# EasyEDA Pro project ProDoc_眼部追踪摄像头主控板.epro

# Schematic Schematic1
Board Name: 主控板1.2; Create Date: 2025-11-02; Page Name: P1; Project Name: FAICAL TRACKER VR模块; Schematic Name: Schematic1_2; Update Date: 2025-12-16; BladeWidth: 10; Company: 嘉立创EDA; Page Size: A4; RegionStart: 1; ShowBorder: 1; TitleBlock: 1; TitleBlockPosition: 3; Version: V1.0; XRegionCount: 6; YRegionCount: 4
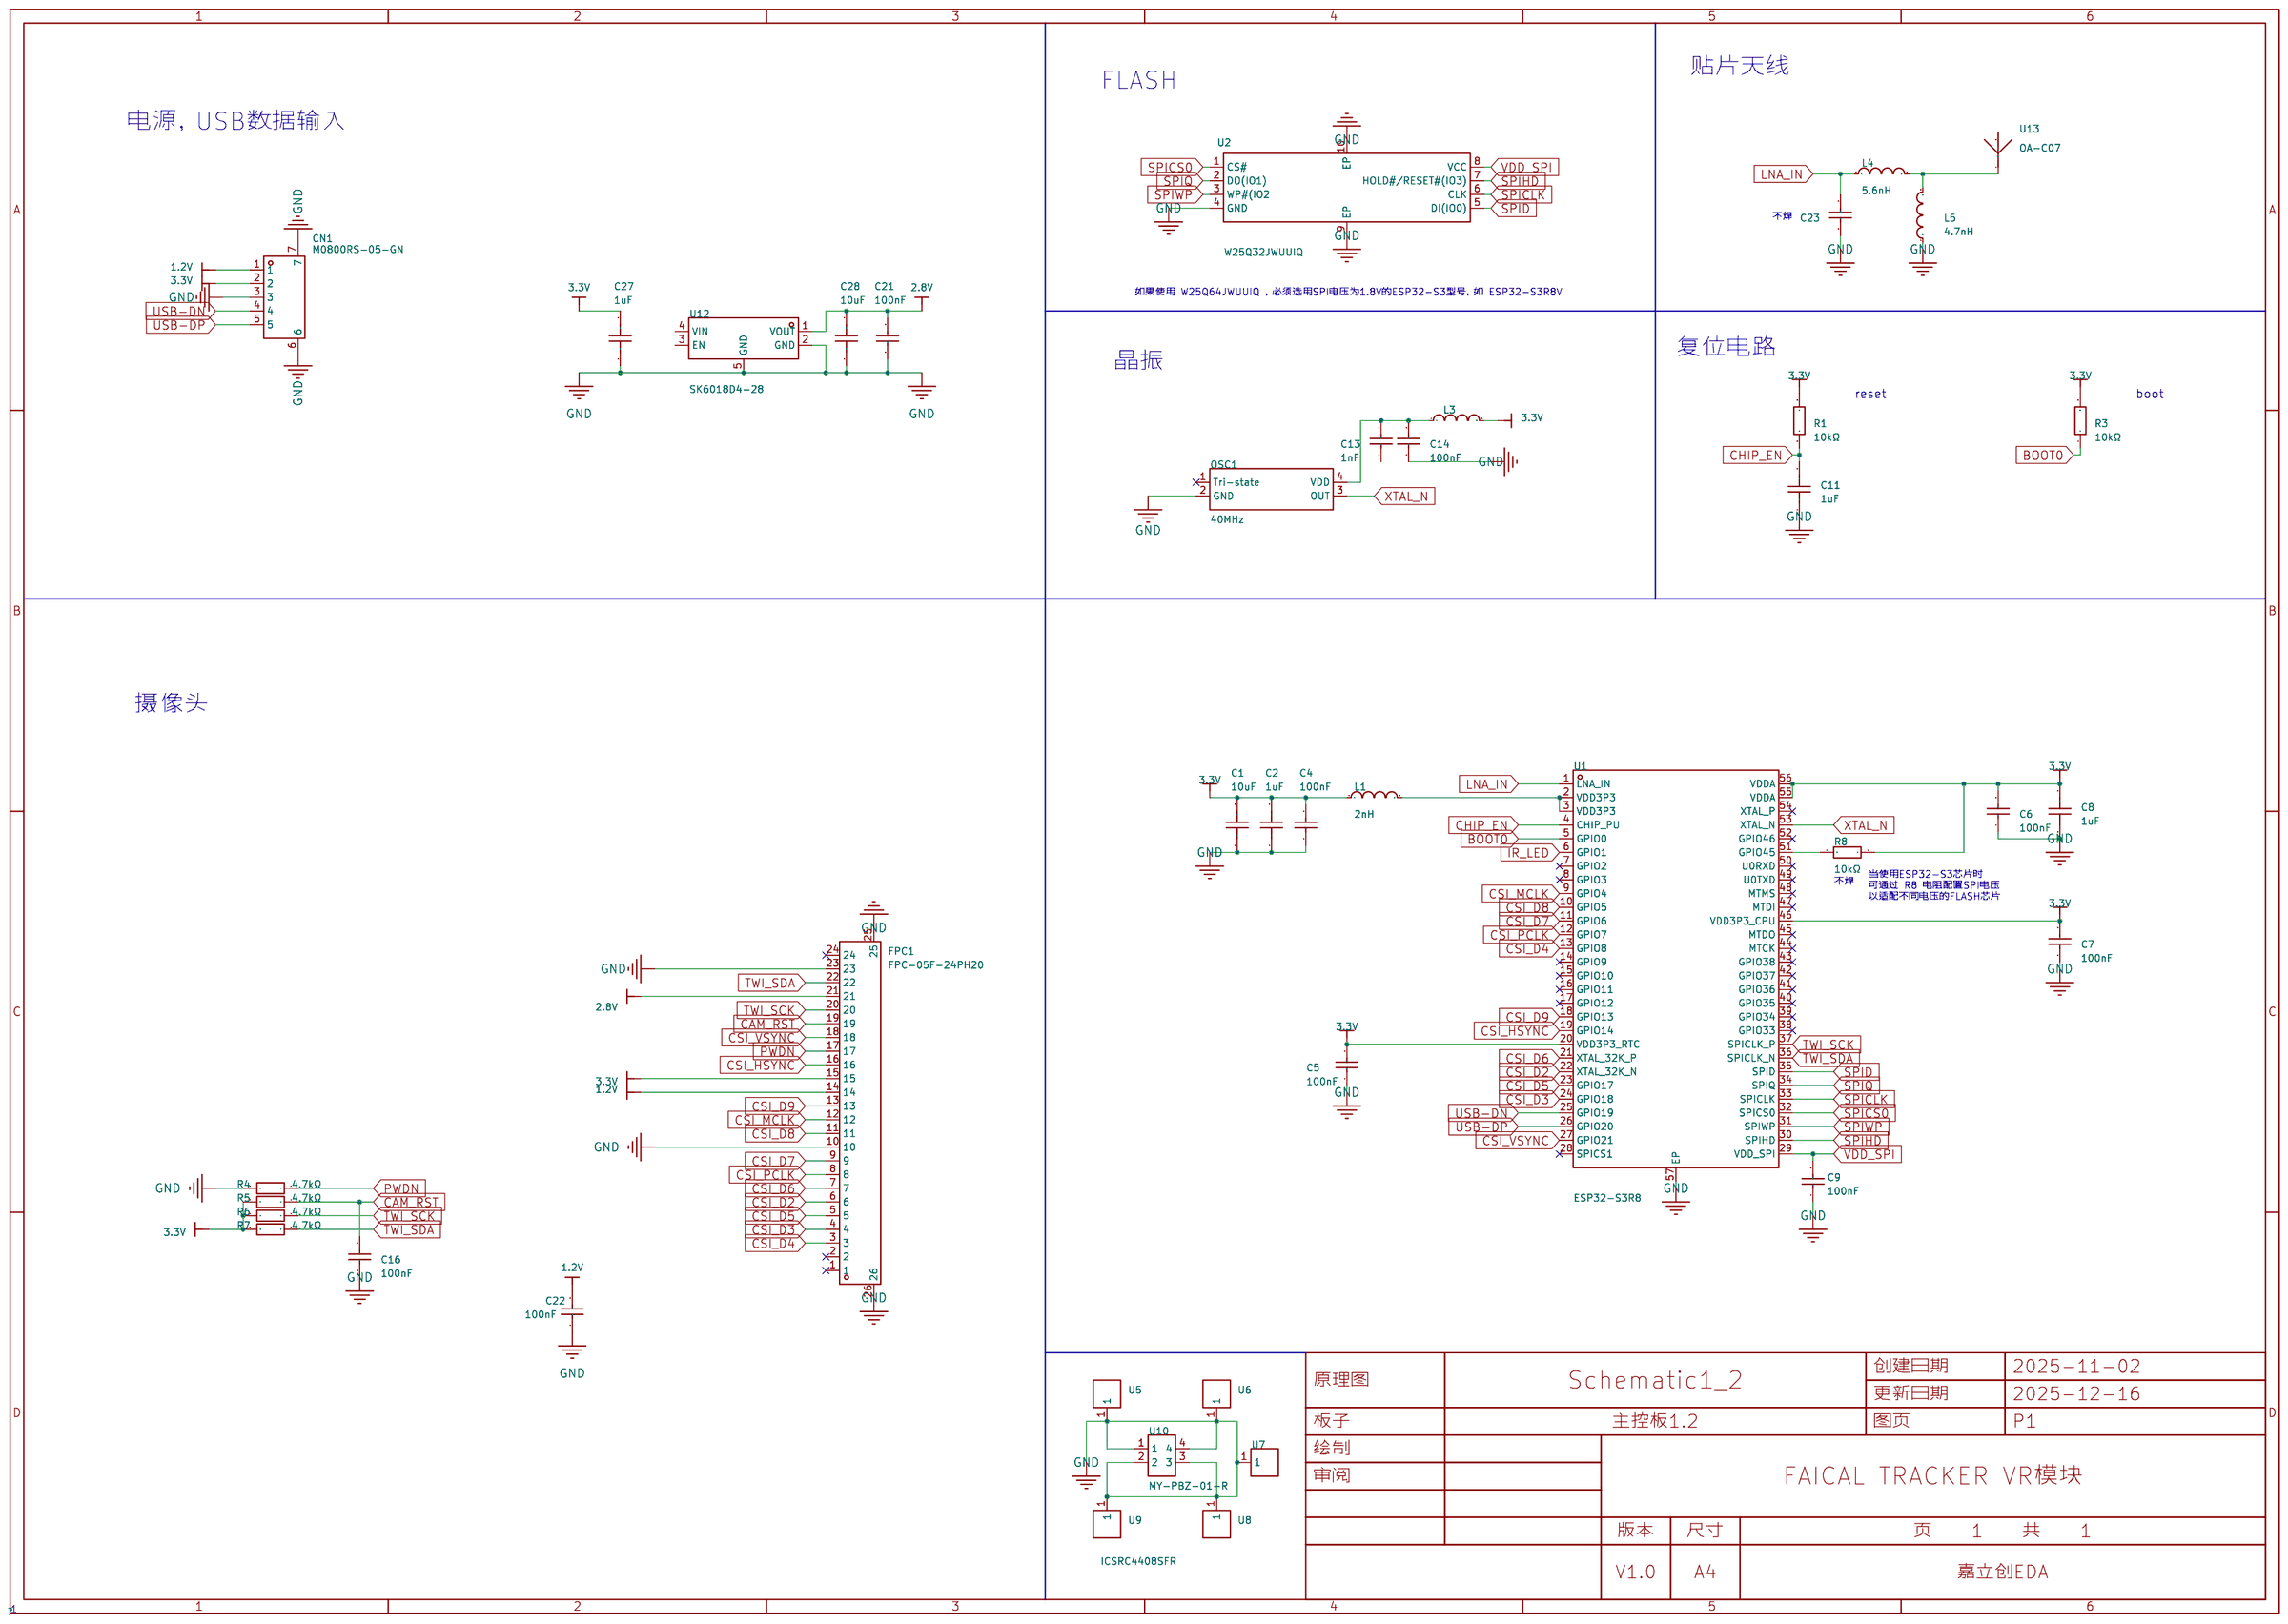
[diagram p0: schematic sheet]

## Parts
C1  10uF  [0402]
C2  1uF  [0402]
C4  100nF  [0402]
C5  100nF  [0402]
C6  100nF  [0402]
C7  100nF  [0402]
C8  1uF  [0402]
C9  100nF  [0402]
C11  1uF  [0402]
C13  1nF  [0402]
C14  100nF  [0402]
C16  100nF  [0402]
C21  100nF  [0402]
C22  100nF  [0402]
C23  1pF  [0402]
C27  1uF  [0402]
C28  10uF  [0402]
CN1  M0800RS-05-GN  [CONN-SMD_M0800RS-05-GN]
FPC1  FPC-05F-24PH20  [FPC-SMD_24P-P0.50_FPC-05F-24PH20]
L1  2nH  [0402]
L3  BLM15PD121SN1D  [0402]
L4  5.6nH  [0402]
L5  4.7nH  [0402]
OSC1  40MHz  [OSC-SMD_4P-L2.0-W1.6-BL_S1D25.000000E10F30T]
R1  10kΩ  [0402]
R3  10kΩ  [0402]
R4  4.7kΩ  [0402]
R5  4.7kΩ  [0402]
R6  4.7kΩ  [0402]
R7  4.7kΩ  [0402]
R8  10kΩ  [0402]
U1  ESP32-S3R8  [QFN-56_L7.0-W7.0-P0.40-TL-EP4.0]
U2  W25Q32JWUUIQ  [USON-8_L4.0-W3.0-P0.80-BL_WINBOND_UU]
U5  ICSRC4408SFR  [屏蔽夹 4.4*0.8]
U6  ICSRC4408SFR  [屏蔽夹 4.4*0.8]
U7  ICSRC4408SFR  [屏蔽夹 4.4*0.8]
U8  ICSRC4408SFR  [屏蔽夹 4.4*0.8]
U9  ICSRC4408SFR  [屏蔽夹 4.4*0.8]
U10  MY-PBZ-01-R  [CONN-SMD_MY-PBZ-01-R]
U12  SK6018D4-28  [XDFN-4_L1.0-W1.0-P0.65-BL-EP]
U13  OA-C07  [ANT-SMD_OA-C07]

## Library data of the parts
C1 C28 = CL05A106MP5NUNC: 容值:10uF;精度:±20%;额定电压:10V;材质(温度系数):X5R;; LCSC Part Name: 10uF ±20% 10V; Supplier Part: C315248; Manufacturer: SAMSUNG(三星); JLCPCB Part Class: Extended Part; Datasheet: https://atta.szlcsc.com/upload/public/pdf/source/20231220/1EF805BAE1520675928CC4638D279E74.pdf; Supplier: LCSC; Tolerance: ±20%; Voltage Rated: 10V; Temperature Coefficient: X5R
C2 C8 C11 C27 = CL05A105KA5NQNC: 容值:1uF;精度:±10%;额定电压:25V;材质(温度系数):X5R;; LCSC Part Name: 1uF ±10% 25V; Supplier Part: C52923; Manufacturer: SAMSUNG(三星); JLCPCB Part Class: 基础库; Datasheet: https://atta.szlcsc.com/upload/public/pdf/source/20160218/1457707763339.pdf; Supplier: LCSC; Tolerance: ±10%; Voltage Rated: 25V; Temperature Coefficient: X5R
C4-C7 C9 C16 C21 C22 = 0402B104K500NT: 容值:100nF;精度:±10%;额定电压:50V;温度系数:X7R;; LCSC Part Name: 100nF ±10% 50V; Supplier Part: C110251; Manufacturer: FH(风华); JLCPCB Part Class: 扩展库; Datasheet: https://atta.szlcsc.com/upload/public/pdf/source/20200305/C486355_26A10D38EF8C2A5C37091D0039909270.pdf; Supplier: LCSC; Tolerance: ±10%; Voltage Rating: 50V; Temperature Coefficient: X7R
C13 = 0402B102K500NT: 容值:1nF;精度:±10%;额定电压:50V;材质(温度系数):X7R;; LCSC Part Name: 1nF ±10% 50V; Supplier Part: C1523; Manufacturer: FH(风华); JLCPCB Part Class: Basic Part; Datasheet: https://atta.szlcsc.com/upload/public/pdf/source/20200305/C486355_26A10D38EF8C2A5C37091D0039909270.pdf; Supplier: LCSC; Tolerance: ±10%; Voltage Rated: 50V; Temperature Coefficient: X7R
C14 = 0402B104K500NT: 容值:100nF;精度:±10%;额定电压:50V;温度系数:X7R;; LCSC Part Name: 100nF ±10% 50V; Supplier Part: C110251; Manufacturer: FH(风华); JLCPCB Part Class: Extended Part; Datasheet: https://atta.szlcsc.com/upload/public/pdf/source/20200305/C486355_26A10D38EF8C2A5C37091D0039909270.pdf; Supplier: LCSC; Tolerance: ±10%; Voltage Rating: 50V; Temperature Coefficient: X7R
C23 = GJM1555C1H1R0BB01D: 容值:1pF;额定电压:50V;温度系数:C0G;; LCSC Part Name: ±0.1pF 1pF 50V; Supplier Part: C76898; Manufacturer: muRata(村田); JLCPCB Part Class: 扩展库; Datasheet: https://item.szlcsc.com/datasheet/GJM1555C1H1R0BB01D/78025.html; Supplier: LCSC; Voltage Rating: 50V; Temperature Coefficient: C0G
CN1 = M0800RS-05-GN: 插针结构:1x5P;间距:0.8mm;安装方式:卧贴;参考系列:-;总PIN数:5P;排数:1;每排PIN数:5;行距:-;额定电流:-;触头材质:磷青铜;工作温度:-;; LCSC Part Name: 1x5P 间距:0.8mm 卧贴; Supplier Part: C509167; Manufacturer: XFCN(兴飞); Supplier Footprint: SMD,P=0.8mm,卧贴; JLCPCB Part Class: Extended Part; Datasheet: https://item.szlcsc.com/datasheet/M0800RS-05-GN/522976.html; Supplier: LCSC; Pins Structure: 1x5P; Pitch: 0.8mm; Mounting Type: 卧贴; Number of Pins: 5P; Number of Rows: 1; Number of PINs Per Row: 5; Contact Material: 磷青铜; Flame Retardant Rating: UL94V-0; Z-Height of the Board: 1.7mm; Y-Width of Bottom Edge on Board: 2.7mm
FPC1 = FPC-05F-24PH20: 锁定特性:翻盖式;触点类型:下接;触点数量:24P;间距:0.5mm;安装类型:卧贴;工作温度范围:-25℃~+85℃;; LCSC Part Name: 间距:0.5mm P数:24P 翻盖式 下接; Supplier Part: C2856805; Manufacturer: XUNPU(讯普); Supplier Footprint: SMD,P=0.5mm,卧贴; JLCPCB Part Class: 扩展库; Datasheet: https://atta.szlcsc.com/upload/public/pdf/source/20210922/C2856805_8542C20E2D7FF0FC4EEBD919AE0F6905.pdf; Supplier: LCSC; Locking Feature: 翻盖式; Contact Type: 下接; Number of Contacts: 24P; Pitch: 0.5mm; Mounting Type: 卧贴; FFC, FCB Thickness: 0.3mm; Height Above Board: 2mm; Operating Temperature Range: -25℃~+85℃
L1 = MLG1005S2N0BT000: 电感值:2nH;精度:-;额定电流:900mA;饱和电流(Isat):-;直流电阻(DCR):70mΩ;; LCSC Part Name: ±0.1nH 2nH; Supplier Part: C76769; Manufacturer: TDK; JLCPCB Part Class: Extended Part; Datasheet: https://atta.szlcsc.com/upload/public/pdf/source/20240116/5498F69597B6145D9954BDAE22913204.pdf; Supplier: LCSC; Current Rating: 900mA; DC Resistance(DCR): 70mΩ; Q @ Frequency: 7@100MHz; Frequency - Self Resonant: 7.5GHz
L3 = BLM15PD121SN1D: 标称阻抗@测试频率:120Ω@100MHz;误差:±25%;直流电阻(RDC):90mΩ;; LCSC Part Name: 单路 0402磁珠 阻抗120Ω@100MHz; Supplier Part: C76891; Manufacturer: muRata(村田); JLCPCB Part Class: 扩展库; Datasheet: https://atta.szlcsc.com/upload/public/pdf/source/20181120/C333978_3E581FB55966932B05020139ABDE8E01.pdf; Supplier: LCSC; Impedance @ Frequency: 120Ω@100MHz; Tolerance: ±25%; DC Resistance: 90mΩ; Current Rating: 1.3A; Circuits: 1
L4 = VHF100505HQ5N6ST: 电感值:5.6nH;额定电流:300mA;饱和电流(Isat):-;直流电阻(DCR):300mΩ;; Supplier Part: C395073; Manufacturer: FH(风华); JLCPCB Part Class: Extended Part; Datasheet: https://atta.szlcsc.com/upload/public/pdf/source/20230208/097A5FD33363C9318A1C8B9447979AC6.pdf; Supplier: LCSC; Rated Current: 300mA; DC Resistance (DCR): 300mΩ
L5 = VHF100505HQ4N7ST: 电感值:4.7nH;额定电流:300mA;饱和电流(Isat):-;直流电阻(DCR):200mΩ;; LCSC Part Name: ±0.3nH 4.7nH; Supplier Part: C395070; Manufacturer: FH(风华); JLCPCB Part Class: Extended Part; Datasheet: https://item.szlcsc.com/datasheet/VHF100505HQ4N7ST/375486.html; Supplier: LCSC; Current Rating: 300mA; DC Resistance(DCR): 200mΩ
OSC1 = OT7EL89CJI-111YLC-40M: 频率:40MHz;常温频差:±10ppm;输出模式:CMOS;工作电压:1.8V~3.3V;频率稳定度:±20ppm;; LCSC Part Name: YSO110TR 40MHZ 4P 2016 1.8V-3.3V ±10PPM -40~85℃ (±20PPM) CMOS; Supplier Part: C7434947; Manufacturer: YXC(扬兴晶振); Supplier Footprint: SMD2016-4P; JLCPCB Part Class: Extended Part; Datasheet: https://atta.szlcsc.com/upload/public/pdf/source/20240731/596E5F7673E50DA744B7F79F139FB8DF.pdf; Supplier: LCSC; Normal temperature Frequency Tolerance: ±10ppm; Output Type: CMOS; Voltage - Supply: 1.8V~3.3V; Frequency Stability: ±20ppm; Operating Temperature: -40℃~+85℃
R1 R3 R8 = 0402WGF1002TCE: 电阻类型:厚膜电阻;阻值:10kΩ;精度:±1%;功率:62.5mW;最大工作电压:50V;温度系数:±100ppm/℃;; LCSC Part Name: 10kΩ ±1% 62.5mW 厚膜电阻; Supplier Part: C25744; Manufacturer: UNI-ROYAL(厚声); JLCPCB Part Class: 基础库; Datasheet: https://atta.szlcsc.com/upload/public/pdf/source/20200306/C422600_1E6D84923E4A46A82E41ADD87F860B5C.pdf; Supplier: LCSC; Type: 厚膜电阻; Tolerance: ±1%; Power(Watts): 62.5mW; Overload Voltage (Max): 50V; Temperature Coefficient: ±100ppm/℃; Operating Temperature Range: -55℃~+155℃
R4-R7 = 0402WGF4701TCE: 电阻类型:厚膜电阻;阻值:4.7kΩ;精度:±1%;功率:62.5mW;工作电压:50V;温度系数:±100ppm/℃;; LCSC Part Name: 4.7kΩ ±1% 62.5mW 厚膜电阻; Supplier Part: C25900; Manufacturer: UNI-ROYAL(厚声); JLCPCB Part Class: Basic Part; Datasheet: https://item.szlcsc.com/datasheet/0402WGF4701TCE/26643.html; Supplier: LCSC; Type: 厚膜电阻; Tolerance: ±1%; Power(Watts): 62.5mW; Overload Voltage (Max): 50V; Temperature Coefficient: ±100ppm/℃; Operating Temperature Range: -55℃~+155℃; Voltage-Supply(Max): 50V; Operating Temperature: -55℃~+155℃
U1 = ESP32-S3R8: 频率范围:2.412GHz~2.484GHz;接口类型:I2C；I2S；UART；USB；SPI;应用领域:蓝牙；IoT；WiFi;数据速率:150Mbps;灵敏度:-74.2dBm;典型应用频率:2.4GHz;; Supplier Part: C2913194; Manufacturer: ESPRESSIF(乐鑫); Supplier Footprint: QFN-56(7x7); JLCPCB Part Class: Extended Part; Datasheet: https://item.szlcsc.com/datasheet/ESP32-S3R8/3198292.html; Supplier: LCSC; Frequency Range: 2.412GHz~2.484GHz; Interface: I2C；I2S；UART；USB；SPI; Voltage - Supply: 3V~3.6V; Applications: 蓝牙；IoT；WiFi; Output Power: 18.5dBm; Data Rate: 150Mbps; Current Of Transmitting: 283mA; Sensitivity: -74.2dBm; Receive Current: 88mA; Typical Application Frequency: 2.4GHz; Operating Temperature: -40℃~+65℃
U2 = W25Q32JWUUIQ: 接口类型:SPI;存储容量:32Mbit;时钟频率(fc):133MHz;; LCSC Part Name: 支持双路、四路SPI接口的1.8V、32Mbit 串行闪存; Supplier Part: C2760370; Manufacturer: Winbond(华邦); Supplier Footprint: USON-8(3x4); JLCPCB Part Class: Extended Part; Datasheet: https://item.szlcsc.com/datasheet/W25Q32JWUUIQ/2881016.html; Supplier: LCSC; Interface: SPI; Memory Size: 32Mbit; Clock Frequency: 133MHz; Voltage - Supply: 1.7V~1.95V; Program / Erase Cycles: 100000次; Page Programming Time (Tpp): 800us; Block Erase Time(tBE): 120ms@(32KB); Data Retention - TDR (Year): 20年
U5-U9 = ICSRC4408SFR: LCSC Part Name: ICT，屏蔽夹 ，长4.4mm*高0.8mm，ICSRC4408SFR; Supplier Part: C238201; Manufacturer: ICT; JLCPCB Part Class: Extended Part; Datasheet: https://item.szlcsc.com/datasheet/ICSRC4408SFR/237762.html; Supplier: LCSC; size: 4.4mm*0.8mm; colour: 白色
U10 = MY-PBZ-01-R: 屏蔽罩PBZ屏蔽框/屏蔽架/屏蔽盖/阻止产品内部电路和生产的电磁波向外辐射，防尘，材质：洋白铜; LCSC Part Name: 屏蔽罩; Supplier Part: C964879; Manufacturer: MYOUNG(美阳); Supplier Footprint: DIP; JLCPCB Part Class: 扩展库; Datasheet: https://item.szlcsc.com/datasheet/MY-PBZ-01-R/1049845.html; Supplier: LCSC; material quality: 洋白铜; characteristic: 阻止产品内部电路和生产的电磁波向外辐射,防尘; size: 13.84*10.47mm
U12 = SK6018D4-28: 输出类型:固定;工作电压:6.5V;输出电压:2.8V;输出电流:300mA;电源纹波抑制比(PSRR):-;输出极性:正极;; LCSC Part Name: 低压差线性稳压器; Supplier Part: C2682757; Manufacturer: suntek(洺太电子); Supplier Footprint: XDFN-4-EP(1x1); JLCPCB Part Class: Extended Part; Datasheet: https://item.szlcsc.com/datasheet/SK6018D4-28/2777833.html; Supplier: LCSC; Output Type: 固定; Voltage - Supply: 6.5V; Output Voltage: 2.8V; Output Current: 300mA; standby current: 1uA; Features: 带使能; Operating Temperature: -40℃~+85℃@(Ta); Output Configuration: 正极; Number of Outputs: 1
U13 = OA-C07: Supplier Part: C9900003278; Supplier Footprint: SMD; JLCPCB Part Class: 扩展库; Supplier: LCSC

## Nets
1.2V: C22.2 CN1.1 FPC1.15
2.8V: C21.2 C28.2 FPC1.21 U12.1(VOUT)
3.3V: C1.2 C2.2 C4.2 C5.2 C6.2 C7.2 C8.2 C27.2 CN1.2 FPC1.14 L1.1 L3.2 R1.2 R3.2 R5.2 R6.2 R7.2 R8.1 U1.20(VDD3P3_RTC) U1.46(VDD3P3_CPU) U1.55(VDDA) U1.56(VDDA) U12.3(EN) U12.4(VIN)
GND: C1.1 C2.1 C4.1 C5.1 C6.1 C7.1 C8.1 C9.1 C11.1 C13.1 C14.1 C16.1 C21.1 C22.1 C23.1 C27.1 C28.1 CN1.3 CN1.6 CN1.7 FPC1.10 FPC1.23 FPC1.25 FPC1.26 L5.1 OSC1.2(GND) R4.2 U1.57(EP) U2.4(GND) U2.9(EP) U2.10(EP) U5.1 U6.1 U7.1 U8.1 U9.1 U10.1 U10.2 U10.3 U10.4 U12.2(GND) U12.5(GND)
VDD_SPI: C9.2 U1.29(VDD_SPI) U2.8(VCC)
BOOT0: R3.1 U1.5(GPIO0)
CAM_RST: C16.2 FPC1.19 R5.1
CHIP_EN: C11.2 R1.1 U1.4(CHIP_PU)
CSI_D2: FPC1.6 U1.22(XTAL_32K_N)
CSI_D3: FPC1.4 U1.24(GPIO18)
CSI_D4: FPC1.3 U1.13(GPIO8)
CSI_D5: FPC1.5 U1.23(GPIO17)
CSI_D6: FPC1.7 U1.21(XTAL_32K_P)
CSI_D7: FPC1.9 U1.11(GPIO6)
CSI_D8: FPC1.11 U1.10(GPIO5)
CSI_D9: FPC1.13 U1.18(GPIO13)
CSI_HSYNC: FPC1.16 U1.19(GPIO14)
CSI_MCLK: FPC1.12 U1.9(GPIO4)
CSI_PCLK: FPC1.8 U1.12(GPIO7)
CSI_VSYNC: FPC1.18 U1.27(GPIO21)
IR_LED: U1.6(GPIO1)
LNA_IN: C23.2 L4.1 U1.1(LNA_IN)
PWDN: FPC1.17 R4.1
SPICLK: U1.33(SPICLK) U2.6(CLK)
SPICS0: U1.32(SPICS0) U2.1(CS#)
SPID: U1.35(SPID) U2.5(DI(IO0))
SPIHD: U1.30(SPIHD) U2.7(HOLD#/RESET#(IO3))
SPIQ: U1.34(SPIQ) U2.2(DO(IO1))
SPIWP: U1.31(SPIWP) U2.3(WP#(IO2)
TWI_SCK: FPC1.20 R6.1 U1.37(SPICLK_P)
TWI_SDA: FPC1.22 R7.1 U1.36(SPICLK_N)
USB-DN: CN1.4 U1.25(GPIO19)
USB-DP: CN1.5 U1.26(GPIO20)
XTAL_N: OSC1.3(OUT) U1.53(XTAL_N)
$1N1778: L1.2 U1.2(VDD3P3) U1.3(VDD3P3)
$1N20382: C13.2 C14.2 L3.1 OSC1.4(VDD)
$1N20736: L4.2 L5.2 U13.1(ANT)
$1N28125: R8.2 U1.51(GPIO45)

Not connected (* = marked no-connect by the designer): FPC1 1* 2* 24*; OSC1 1(Tri-state)*; U1 7(GPIO2)* 8(GPIO3)* 14(GPIO9)* 15(GPIO10)* 16(GPIO11)* 17(GPIO12)* 28(SPICS1)* 38(GPIO33)* 39(GPIO34)* 40(GPIO35)* 41(GPIO36)* 42(GPIO37)* 43(GPIO38)* 44(MTCK)* 45(MTDO)* 47(MTDI)* 48(MTMS)* 49(U0TXD)* 50(U0RXD)* 52(GPIO46)* 54(XTAL_P)*; U13 2

## Notes on the sheet
- 贴片天线
- FLASH
- 电源，USB数据输入
- 不焊
- 如果使用 W25Q64JWUUIQ ，必须选用SPI电压为1.8V的ESP32-S3型号，如 ESP32-S3R8V
- 晶振
- 复位电路
- reset
- boot
- 摄像头
- 当使用ESP32-S3芯片时
  可通过 R8 电阻配置SPI电压
  以适配不同电压的FLASH芯片
- 不焊

# Board PCB1
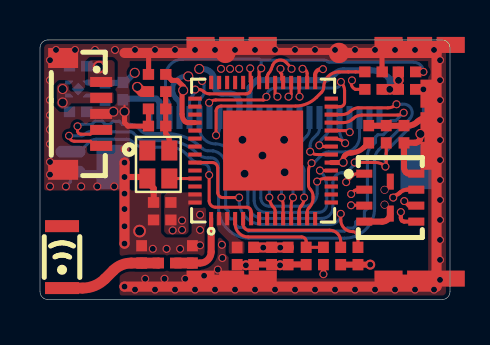
[diagram p1: board, top side]
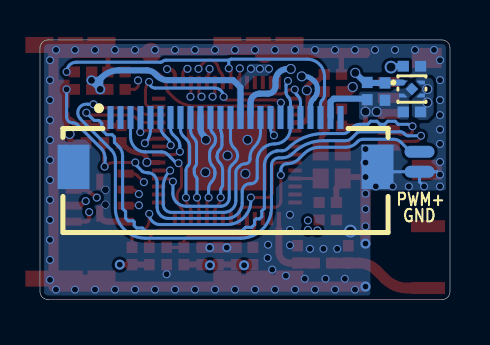
[diagram p2: board, bottom side, seen from below]

Outline 20.5 x 13 mm; copper layers: Top Layer, Inner1, Inner2, Bottom Layer. Coordinates in mm from the lower left corner of the outline.
Outline path: 0,12.6 0,0.4 arc(0.12,0.12) 0.4,0 20.1,0 arc(20.38,0.12) 20.5,0.4 20.5,12.6 arc(20.38,12.88) 20.1,13 0.4,13 arc(0.12,12.88) 0,12.6
Stack: Top Layer 0.035mm 外层铜厚1oz / SUBSTRATE1 0.28mm 7628 RC49% 8.6mil / Inner1 0.035mm 内层铜厚 / Dielectric2 0.28mm 1.1mm H/HOZ Copper / Inner2 0.035mm 内层铜厚 / Dielectric3 0.28mm 7628 RC49% 8.6mil / Bottom Layer 0.035mm 外层铜厚1oz

## Design rules (mm)
net USB-DN: DP1
net USB-DP: DP1
spacing copperThickness1oz (default): track to track 0.152, other pairs 0.152 to 0.3
spacing copperThickness2oz: track to track 0.203, other pairs 0.152 to 0.3
spacing Plane_innerPlane: track to track 0.152, other pairs 0.152 to 0.3
spacing Copper_copperRegion: track to track 0.152, other pairs 0.152 to 0.3
spacing Copper_copperRegion1: track to track 0.152, other pairs 0.152 to 0.3
track width copperThickness1oz (default): min 0.127, default 0.254, max 2.54
track width copperThickness2oz: min 0.203, default 0.254, max 2.54
differential pair differentialPair (default): width min 0.127, default 0.254, max 2.54; gap min 0.152, default 0.152
differential pair USB-90Ω: width min 0.152, default 0.157, max 0.203; gap min 0.203, default 0.203
net GND uses copperRegion1_copperThickness1oz
net 3.3V uses copperRegion1_copperThickness1oz
net $1N1778 uses copperRegion1_copperThickness1oz
net USB-DN uses USB-90Ω
net USB-DP uses USB-90Ω
diff pair DP1 uses USB-90Ω
pour e882 uses Copper_copperRegion1, copperRegion1_Copper_copperRegion1
pour e884 uses Copper_copperRegion1, copperRegion1_Copper_copperRegion1
pour e886 uses Copper_copperRegion1, copperRegion1_Copper_copperRegion1
pour e888 uses Copper_copperRegion1, copperRegion1_Copper_copperRegion1
pour e892 uses Copper_copperRegion1, copperRegion1_Copper_copperRegion1
pour e896 uses Copper_copperRegion, copperRegion1_Copper_copperRegion
pour e880 uses Copper_copperRegion1
pour e894 uses Copper_copperRegion1
pour e898 uses Copper_copperRegion1

## Placement (name value [footprint] x y rotation side)
C1  10uF  [0402]  12.41 2.18 270 top
C2  1uF  [0402]  11.58 2.18 270 top
C4  100nF  [0402]  10.68 2.18 270 top
C5  100nF  [0402]  16.43 8.28 270 top
C6  100nF  [0402]  6.11 4.86 0 top
C7  100nF  [0402]  5.86 11.28 0 top
C8  1uF  [0402]  6.11 3.99 0 top
C9  100nF  [0402]  18.2 8.28 270 top
C11  1uF  [0402]  14.17 2.18 90 top
C13  1nF  [0402]  5.86 8.68 0 top
C14  100nF  [0402]  5.86 9.55 0 top
C16  100nF  [0402]  17.31 8.28 270 top
C21  100nF  [0402]  4.14 10.44 90 bottom
C22  100nF  [0402]  1.91 11.68 0 bottom
C23  1pF  [0402]  7.62 2.26 270 top
C27  1uF  [0402]  1.91 9.4 180 bottom
C28  10uF  [0402]  3.25 10.41 90 bottom
CN1  M0800RS-05-GN  [CONN-SMD_M0800RS-05-GN]  2.06 9.3 270 top
FPC1  FPC-05F-24PH20  [FPC-SMD_24P-P0.50_FPC-05F-24PH20]  11.22 7.93 180 bottom
L1  2nH  [0402]  9.86 2.18 90 top
L3  BLM15PD121SN1D  [0402]  5.86 10.41 180 top
L4  5.6nH  [0402]  6.35 1.83 180 top
L5  4.7nH  [0402]  5.08 2.26 270 top
NOREF  -  [Pad_e161]  1.52 7.4 180 top
NOREF#2  -  [Pad_e162]  1.52 6.4 180 top
OSC1  40MHz  [OSC-SMD_4P-L2.0-W1.6-BL_S1D25.000000E10F30T]  5.92 6.76 270 top
R1  10kΩ  [0402]  13.31 2.18 270 top
R3  10kΩ  [0402]  15.03 2.18 270 top
R4  4.7kΩ  [0402]  16.68 11.4 0 top
R5  4.7kΩ  [0402]  18.35 10.53 180 top
R6  4.7kΩ  [0402]  16.68 10.53 0 top
R7  4.7kΩ  [0402]  18.35 11.4 180 top
R8  10kΩ  [0402]  15.9 2.18 90 top
U1  ESP32-S3R8  [QFN-56_L7.0-W7.0-P0.40-TL-EP4.0]  11.16 7.46 90 top
U2  W25Q32JWUUIQ  [USON-8_L4.0-W3.0-P0.80-BL_WINBOND_UU]  17.51 5.1 270 top
U5  ICSRC4408SFR  [屏蔽夹 4.4*0.8]  7.33 12.35 0 top
U6  ICSRC4408SFR  [屏蔽夹 4.4*0.8]  16.73 12.35 0 top
U7  ICSRC4408SFR  [屏蔽夹 4.4*0.8]  19.83 6.5 90 top
U8  ICSRC4408SFR  [屏蔽夹 4.4*0.8]  16.73 0.65 0 top
U9  ICSRC4408SFR  [屏蔽夹 4.4*0.8]  7.33 0.65 0 top
U10  MY-PBZ-01-R  [CONN-SMD_MY-PBZ-01-R]  12.03 6.5 90 top
U12  SK6018D4-28  [XDFN-4_L1.0-W1.0-P0.65-BL-EP]  1.91 10.54 270 bottom
U13  OA-C07  [ANT-SMD_OA-C07]  1.1 2.13 90 top

## Footprints (pads in the part's own frame, mm; a bottom-side part is the same pattern mirrored in y, then rotated)
0402
  rect 0.566x0.54 smd: 1(-0.433,0) 2(0.433,0)
ANT-SMD_OA-C07
  rect 0.6x1.7 smd: 1(-1.55,0) 2(1.55,0)
CONN-SMD_M0800RS-05-GN
  rect 0.5x1.1 smd: 1(-1.6,1) 2(-0.8,1) 3(0,1) 4(0.8,1) 5(1.6,1)
  rect 1x1.5 smd: 6(2.8,-0.9) 7(-2.8,-0.9)
CONN-SMD_MY-PBZ-01-R
  rect 0.1x0.5 smd: 1(-5.85,0) 2(5.85,0)
  rect 0.5x0.1 smd: 3(3,7.8) 4(-3,-7.8)
FPC-SMD_24P-P0.50_FPC-05F-24PH20
  rect 0.3x1.15 smd: 1(-5.75,1.188) 2(-5.25,1.188) 3(-4.75,1.188) 4(-4.25,1.188) 5(-3.75,1.188) 6(-3.25,1.188) 7(-2.75,1.188) 8(-2.25,1.188) 9(-1.75,1.188) 10(-1.25,1.188) 11(-0.75,1.188) 12(-0.25,1.188) 13(0.25,1.188) 14(0.75,1.188) 15(1.25,1.188) 16(1.75,1.188) 17(2.25,1.188) 18(2.75,1.188) 19(3.25,1.188) 20(3.75,1.188) 21(4.25,1.188) 22(4.75,1.188) 23(5.25,1.188) 24(5.75,1.188)
  rect 1.6x2.22 smd: 25(7.6,-1.288) 26(-7.6,-1.288)
OSC-SMD_4P-L2.0-W1.6-BL_S1D25.000000E10F30T
  rect 1x0.8 smd: 1(-0.7,-0.55) 2(0.7,-0.55) 3(0.7,0.55) 4(-0.7,0.55)
Pad_e161
  oval 1.5x0.6 smd far side: 1(0,0)
Pad_e162
  oval 1.5x0.6 smd far side: 1(0,0)
QFN-56_L7.0-W7.0-P0.40-TL-EP4.0
  rect 0.665x0.2 smd: 1(-3.408,2.6) 2(-3.408,2.2) 3(-3.408,1.8) 4(-3.408,1.4) 5(-3.408,1) 6(-3.408,0.6) 7(-3.408,0.2) 8(-3.408,-0.2) 9(-3.408,-0.6) 10(-3.408,-1) 11(-3.408,-1.4) 12(-3.408,-1.8) 13(-3.408,-2.2) 14(-3.408,-2.6) 29(3.408,-2.6) 30(3.408,-2.2) 31(3.408,-1.8) 32(3.408,-1.4) 33(3.408,-1) 34(3.408,-0.6) 35(3.408,-0.2) 36(3.408,0.2) 37(3.408,0.6) 38(3.408,1) 39(3.408,1.4) 40(3.408,1.8) 41(3.408,2.2) 42(3.408,2.6)
  rect 0.2x0.665 smd: 15(-2.6,-3.408) 16(-2.2,-3.408) 17(-1.8,-3.408) 18(-1.4,-3.408) 19(-1,-3.408) 20(-0.6,-3.408) 21(-0.2,-3.408) 22(0.2,-3.408) 23(0.6,-3.408) 24(1,-3.408) 25(1.4,-3.408) 26(1.8,-3.408) 27(2.2,-3.408) 28(2.6,-3.408) 43(2.6,3.408) 44(2.2,3.408) 45(1.8,3.408) 46(1.4,3.408) 47(1,3.408) 48(0.6,3.408) 49(0.2,3.408) 50(-0.2,3.408) 51(-0.6,3.408) 52(-1,3.408) 53(-1.4,3.408) 54(-1.8,3.408) 55(-2.2,3.408) 56(-2.6,3.408)
  rect 4x4 smd: 57(0,0)
USON-8_L4.0-W3.0-P0.80-BL_WINBOND_UU
  rect 0.4x0.8 smd: 1(-1.2,-1.3) 2(-0.4,-1.3) 3(0.4,-1.3) 4(1.2,-1.3) 5(1.2,1.3) 6(0.4,1.3) 7(-0.4,1.3) 8(-1.2,1.3)
  rect 0.8x0.35 smd: 9(-0.802,0) 10(0.798,0)
XDFN-4_L1.0-W1.0-P0.65-BL-EP
  custom 0.2x0.45 smd: 1(-0.325,-0.475)
  custom 0.2x0.4 smd: 2(0.325,-0.475) 3(0.325,0.475) 4(-0.325,0.475)
  rect 0.45x0.45 smd rot 135: 5(0,0)
屏蔽夹 4.4*0.8
  custom 4.51x0.8 smd: 1(2.255,0.4)

## Nets
As in the schematic, except:
GND: C1.1 C2.1 C4.1 C5.1 C6.1 C7.1 C8.1 C9.1 C11.1 C13.1 C14.1 C16.1 C21.1 C22.1 C23.1 C27.1 C28.1 CN1.3 CN1.6 CN1.7 FPC1.10 FPC1.23 FPC1.25 FPC1.26 L5.1 NOREF#2.1 OSC1.2 R4.2 U1.57 U2.4 U2.9 U2.10 U5.1 U6.1 U7.1 U8.1 U9.1 U10.1 U10.2 U10.3 U10.4 U12.2 U12.5
IR_LED: NOREF.1 U1.6

Pads without a net: FPC1 1 2 24; OSC1 1; U1 7 8 14 15 16 17 28 38 39 40 41 42 43 44 45 47 48 49 50 52 54; U13 2

## Via types
v1: diameter 0.5, hole 0.4, Top Layer to Bottom Layer, 10 vias
v2: diameter 0.4, hole 0.3, Top Layer to Bottom Layer, 87 vias
v3: diameter 0.45, hole 0.3, Top Layer to Bottom Layer, 2 vias
v4: diameter 0.399, hole 0.299, Top Layer to Bottom Layer, 17 vias
v5: diameter 0.5, hole 0.3, Top Layer to Bottom Layer, 5 vias
v6: diameter 0.635, hole 0.45, Top Layer to Bottom Layer, 2 vias
v7: diameter 0.5, hole 0.399, Top Layer to Bottom Layer, 5 vias
v8: diameter 0.4, hole 0.35, Top Layer to Bottom Layer, 2 vias
v9: diameter 0.5, hole 0.35, Top Layer to Bottom Layer, 2 vias
v10: diameter 0.5, hole 0.299, Top Layer to Bottom Layer, 1 via
v11: diameter 0.45, hole 0.35, Top Layer to Bottom Layer, 1 via
v12: diameter 0.4, hole 0.299, Top Layer to Bottom Layer, 26 vias

## Routing (per net, layer and track width the routed paths; a pad name or vN(x,y) marks a point on that pad's centre or on a via; arc(x,y) is an arc through that point)
1.2V: length 9.7
  Inner2 w0.254: v6(2.95,11.64) 3.3,11.99 7.52,11.99 v1(7.96,11.55)
  Bottom Layer w0.305: C22.2 2.91,11.68 v6(2.95,11.64) ; 9.97,9.22 9.97,9.86 arc(9.84,10.18) 9.52,10.31 9.11,10.31 arc(8.84,10.42) 8.73,10.69 8.73,10.95 arc(8.55,11.37) 8.13,11.55 v1(7.96,11.55)
2.8V: length 8
  Inner2 w0.305: v1(7.41,11.18) 7.11,11.48 4.86,11.48 v7(4.74,11.35)
  Bottom Layer w0.254: 6.97,9.22 6.97,9.72 arc(6.94,9.89) 6.85,10.03 6.81,10.06 arc(6.8,10.08) 6.78,10.1 6.78,10.1 arc(6.73,10.17) 6.68,10.25 arc(6.68,10.26) 6.67,10.27 arc(6.66,10.31) 6.65,10.35 arc(6.63,10.44) 6.63,10.52 6.63,10.58 arc(6.67,10.76) 6.77,10.91 6.83,10.98 arc(7.07,11.14) 7.35,11.19 7.37,11.18 v1(7.41,11.18)
  Bottom Layer w0.305: U12.1 3.23,10.87 C28.2 4.12,10.85 C21.2 4.26,10.87 v7(4.74,11.35)
3.3V: length 23.1
  Top Layer w0.254: v11(15.16,6.87) 15.16,7 arc(15.18,7.12) 15.25,7.23 arc(15.38,7.31) 15.53,7.34 arc(15.54,7.34) 15.54,7.34 arc(15.59,7.35) 15.63,7.35 arc(15.94,7.44) 16.2,7.62 16.43,7.85 ; U1.46 7.38,8.86 arc(7.31,8.87) 7.25,8.91 arc(7.14,9.08) 7.1,9.28 7.1,10.41 v1(7.16,10.47) 7.16,10.68 6.87,10.97 6.59,10.97 C7.2 ; U1.20 15.09,6.86
  Top Layer w0.305: R3.2 R8.1 v5(16.51,1.75) ; 13.31,1.76 9.86,1.76
  Top Layer w0.508: 5.43,10.41 5.1,10.41 v1(4.86,10.64) ; 17.93,10.53 v9(17.49,10.53) 17.1,10.53 ; 17.93,11.4 v9(17.93,10.98)
  Bottom Layer w0.305: 10.47,10.37 10.47,10.62 10.84,10.99 14.12,10.99 arc(14.4,11.04) 14.64,11.2 arc(14.69,11.26) 14.74,11.3 arc(14.94,11.43) 15.17,11.48 16.55,11.48 arc(17.02,11.39) 17.41,11.12 ; 10.47,10.31 10.47,9.22 ; 17.41,11.12 arc(17.47,11.04) 17.49,10.94 v9(17.49,10.53) 17.93,10.96 v9(17.93,10.98) 17.77,10.98 arc(17.58,11.01) 17.41,11.12
  vias: v2(6.63,3.46) v2(7.1,3.96) v2(7.1,3.49) v2(9.05,11.55) v2(9.5,11.55) v2(9.96,11.55) v5(12,1.72) v7(1.13,10.54) v7(1.13,9.87) v10(10.29,1.72)
GND: length 133.5
  Top Layer w0.254: C14.1 C13.1 4.4,8.68 4.22,8.86 4.22,9.39 ; 7.33,12.35 5.43,12.35 5.43,11.28 ; 14.17,1.76 v2(14.17,1.27) ; 16.73,12.35 16.94,12.35 17.1,12.19 17.1,11.4
  Top Layer w0.305: 5.68,4.86 5.68,5.57 5.37,5.89 OSC1.2 5.29,6.14 v2(4.22,6.14) ; 19.8,9.09 19.31,9.09 arc(19.08,9.04) 18.89,8.91 arc(18.65,8.76) 18.38,8.7 16.43,8.7 ; U2.4 17.11,3.9 arc(17.4,4.02) U2.10
  Top Layer w0.355: 9.19,12.43 15.02,12.43
  Top Layer w0.508: v5(4.23,2.8) v5(4.22,6.86) ; 4.23,12.35 9.27,12.35 ; v5(4.23,0.65) 19.83,0.65 19.83,12.35 14.95,12.35 ; 10.72,2.61 12.44,2.61
  Inner1 w0.305: v2(4.22,6.14) 5.13,6.14
  Inner2 w0.457: 0.5,5.72 0.5,12.14 arc(0.6,12.4) 0.86,12.5 19.64,12.5 arc(19.9,12.4) 20,12.14 20,0.86 arc(19.9,0.6) 19.64,0.5 4.23,0.53 ; 4.23,0.53 4.75,0.53 ; 4.23,0.53 v5(4.23,0.65) ; 0.53,5.66 v2(1.3,5.66) v2(2.06,5.66) v2(2.86,5.66) v2(3.71,5.66) 4.23,5.66 v4(4.23,5.3) v4(4.23,4.53) v4(4.23,3.67) v5(4.23,2.8)
  Bottom Layer w0.127: 3.38,6.4 FPC1.25
  Bottom Layer w0.152: v2(1.3,5.66) 1.52,5.89 NOREF.1 ; NOREF.1 3.38,6.4 ; NOREF.1 0.64,6.4 v2(0.5,6.26)
  Bottom Layer w0.305: 12.47,9.22 12.47,8.56 arc(12.44,8.38) 12.34,8.24 12.3,8.19 arc(12.24,8.11) 12.21,8.02 arc(12.18,8.02) v1(12.21,8) ; 4.19,9.98 4.27,10.06 5.82,10.06 5.97,9.9 FPC1.23
  vias: v4(5.26,1.04) v4(5.64,2.54) v4(6.23,1.04) v4(7.26,1.04) v4(8,3.49) v4(8,2.72) v4(8.2,1.19) v4(8.89,1.5) v4(9.09,2.74) v4(9.12,2.08) v2(0.5,11.99) v2(0.5,10.99) v2(0.5,9.99) v2(0.5,9.23) v2(0.5,8.51) v2(0.5,7.79) v2(0.5,6.89) v2(0.5,5.66) v2(0.8,12.5) v2(1.75,12.5) v2(2.75,12.5) v2(3.75,12.5) v2(4.22,7.54) v2(4.75,12.5) v2(4.75,0.5) v2(5.75,12.5) v2(5.75,0.5) v2(6.33,2.54) v2(6.75,12.5) v2(6.75,0.5) v2(7,2.54) v2(7.75,12.5) v2(7.75,0.5) v2(8,4.25) v2(8.75,12.5) v2(8.75,0.5) v2(9.75,12.5) v2(9.75,0.5) v2(10.75,12.5) v2(10.75,0.5) v2(11.75,12.5) v2(11.75,0.5) v2(12.75,12.5) v2(12.75,0.5) v2(13.75,12.5) v2(13.75,0.5) v2(14.75,12.5) v2(14.75,0.5) v2(15.75,12.5) v2(15.75,0.5) v2(16.75,12.5) v2(16.75,0.5) v2(17.75,12.5) v2(17.75,0.5) v2(18.75,12.5) v2(18.75,0.5) v2(19.7,12.5) v2(19.7,0.5) v2(20,11.99) v2(20,10.99) v2(20,9.99) v2(20,8.99) v2(20,7.99) v2(20,6.99) v2(20,5.99) v2(20,4.99) v2(20,3.99) v2(20,2.99) v2(20,1.99) v2(20,0.99) v3(11.16,2.6) v3(12.01,2.6) v8(17.23,5.5) v8(17.23,4.75) v1(10.12,8) v1(10.23,6.3) v1(11.12,7.21) v1(12.23,6.37) v7(3.67,9.41) v7(4.23,9.41) v6(4.98,3.43)
VDD_SPI: length 11.9
  Top Layer w0.203: v12(14.15,11.54) 14.06,11.54 arc(13.84,11.45) 13.76,11.23 U1.29
  Top Layer w0.305: v1(19.02,8.29) 19.02,8.13 arc(19,8.02) 18.94,7.92 arc(18.86,7.87) 18.77,7.85 18.2,7.85 18.2,6.62 arc(18.23,6.49) 18.3,6.37 arc(18.38,6.32) 18.47,6.3 U2.8
  Inner2 w0.305: v1(19.02,8.29) 19.02,9.19 arc(18.97,9.46) 18.81,9.7 arc(18.62,9.98) 18.56,10.31 18.56,10.99 arc(18.32,11.55) 17.76,11.78 14.39,11.78 arc(14.22,11.71) v12(14.15,11.54)
BOOT0: length 6
  Top Layer w0.152: U1.5 10.16,3.76 arc(10.24,3.56) 10.44,3.47 14.48,3.47 arc(14.87,3.31) 15.03,2.92 R3.1
CAM_RST: length 23.4
  Top Layer w0.152: 18.78,10.53 v2(19.17,10.53) ; v2(15.73,6.87) 16.77,6.87 arc(17.04,6.81) 17.27,6.66 arc(17.27,6.66) v2(17.27,6.66) arc(17.3,6.7) 17.31,6.75 17.31,7.85
  Bottom Layer w0.152: v2(19.17,10.53) 19.17,9.14 arc(19.08,8.94) 18.88,8.85 arc(18.75,8.83) 18.64,8.77 17.43,7.55 arc(17.3,7.34) 17.24,7.09 arc(17.24,7.07) 17.24,7.06 arc(17.25,6.86) v2(17.27,6.66) ; v2(15.73,6.87) arc(15.72,6.78) 15.67,6.71 15.37,6.41 arc(15.25,6.37) 15.12,6.35 15.1,6.35 arc(14.94,6.32) 14.8,6.23 arc(14.68,6.05) 14.64,5.85 14.64,4.61 arc(14.48,4.22) 14.09,4.06 11.16,4.06 arc(10.62,4.29) 10.39,4.83 10.39,5.41 arc(10.28,5.69) 10,5.8 9.95,5.8 arc(9.73,5.89) 9.64,6.11 9.64,6.93 arc(9.62,7.09) 9.58,7.25 arc(9.46,7.45) 9.31,7.61 arc(9.06,7.75) 8.78,7.8 ; 8.77,7.8 arc(8.21,8.03) 7.97,8.59 FPC1.19 7.97,9.85 arc(8.01,10.01) 8.1,10.15 arc(8.17,10.26) 8.2,10.39 8.2,10.71 arc(8.17,10.84) v2(8.1,10.95)
CHIP_EN: length 5.5
  Top Layer w0.152: U1.4 9.76,3.79 arc(9.95,3.33) 10.41,3.14 13.08,3.14 arc(13.24,3.07) 13.31,2.91 R1.1 C11.2
CSI_D2: length 2.3
  Top Layer w0.152: U1.22 14.12,7.66 arc(14.1,7.66) 14.07,7.67 arc(14.01,7.69) v12(13.97,7.73)
  Bottom Layer w0.152: 14.47,9.22 14.47,8.68 arc(14.43,8.43) 14.29,8.23 14.09,8.03 arc(14,7.89) v12(13.97,7.73)
CSI_D3: length 1.8
  Top Layer w0.152: U1.24 15.41,8.46 v12(15.49,8.38)
  Bottom Layer w0.152: 15.47,9.22 15.49,9.2 v12(15.49,8.38)
CSI_D4: length 7
  Top Layer w0.152: U1.13 13.36,4.37 arc(13.38,4.49) 13.45,4.59 arc(13.6,4.82) 13.65,5.09 13.65,5.17 arc(13.61,5.37) 13.5,5.53 arc(13.44,5.62) 13.42,5.72 13.42,6.47 arc(13.46,6.66) v2(13.58,6.83)
  Bottom Layer w0.152: FPC1.3 15.97,8.17 arc(15.91,7.86) 15.74,7.59 arc(15.52,7.45) 15.26,7.39 14.43,7.39 arc(14.26,7.36) 14.11,7.26 13.75,6.9 arc(13.67,6.85) v2(13.58,6.83)
CSI_D5: length 2.1
  Top Layer w0.152: U1.23 14.7,8.06 arc(15,8) v12(15.26,7.83)
  Bottom Layer w0.152: FPC1.5 14.97,8.51 arc(15.05,8.14) v12(15.26,7.83)
CSI_D6: length 3.1
  Top Layer w0.152: U1.21 13.86,7.26 arc(13.67,7.3) v12(13.51,7.4)
  Bottom Layer w0.152: v12(13.51,7.4) 13.51,7.7 arc(13.55,7.9) 13.66,8.07 13.85,8.26 arc(13.94,8.4) 13.97,8.56 13.97,9.22
CSI_D7: length 5.3
  Top Layer w0.152: U1.11 12.56,4.61 arc(12.57,4.86) v12(12.65,5.11)
  Bottom Layer w0.152: 12.97,9.22 12.97,8.51 arc(12.93,8.28) 12.79,8.08 arc(12.73,7.99) 12.69,7.89 arc(12.68,7.84) 12.67,7.79 ; 12.67,7.75 12.67,6.81 arc(12.69,6.74) 12.73,6.67 arc(12.77,6.61) 12.79,6.54 12.79,6.37 arc(12.76,6.24) 12.69,6.14 arc(12.66,6.09) 12.65,6.03 v12(12.65,5.11)
CSI_D8: length 5.5
  Top Layer w0.152: U1.10 12.16,4.6 arc(12.15,4.86) v12(12.07,5.11)
  Bottom Layer w0.152: v12(12.07,5.11) 12.07,5.54 arc(12.03,5.73) 11.93,5.89 arc(11.8,6.08) 11.75,6.31 11.75,6.37 arc(11.76,6.46) 11.78,6.54 arc(11.83,6.63) 11.89,6.7 arc(11.89,6.71) 11.9,6.72 arc(11.99,6.9) 12.02,7.09 12.02,7.3 arc(11.98,7.49) 11.88,7.65 arc(11.84,7.69) 11.8,7.74 arc(11.75,7.84) 11.73,7.94 arc(11.73,7.95) 11.73,7.96 arc(11.73,7.96) 11.73,7.96 11.73,8.04 arc(11.76,8.18) 11.84,8.31 arc(11.87,8.34) 11.89,8.37 arc(11.95,8.49) 11.97,8.63 11.97,9.22
CSI_D9: length 9.1
  Top Layer w0.152: 13.9,5.81 13.9,5.8 ; U1.18 14.22,6.06 arc(14.02,6.02) v12(13.86,5.91)
  Bottom Layer w0.152: v12(13.86,5.91) 13.86,5.3 arc(13.81,5.07) 13.68,4.87 arc(13.45,4.72) 13.19,4.67 11.46,4.67 arc(11.16,4.8) 11.04,5.09 11.04,6.43 arc(11.01,6.59) 10.92,6.72 10.75,6.89 arc(10.65,7.03) 10.62,7.2 arc(10.66,7.39) 10.77,7.56 10.84,7.63 arc(10.94,7.82) 10.97,8.03 10.97,9.22
CSI_HSYNC: length 11.3
  Top Layer w0.152: U1.19 14,6.46
  Bottom Layer w0.152: FPC1.16 9.47,8.38 arc(9.55,7.98) 9.78,7.65 arc(9.94,7.4) 10,7.11 10,7.03 arc(10.07,6.87) 10.23,6.8 arc(10.39,6.77) 10.53,6.67 10.62,6.59 arc(10.68,6.49) 10.71,6.38 10.71,4.95 arc(10.88,4.54) 11.29,4.37 13.94,4.37 arc(14.22,4.48) 14.34,4.77 14.34,5.63 arc(14.25,6.08) v12(14,6.46)
CSI_MCLK: length 5.6
  Top Layer w0.152: U1.9 11.76,4.44 arc(11.73,4.56) 11.65,4.65 arc(11.52,4.86) v12(11.47,5.11)
  Bottom Layer w0.152: 11.47,9.22 11.47,8.57 arc(11.47,8.51) 11.46,8.45 arc(11.44,8.4) 11.43,8.36 arc(11.42,8.32) 11.42,8.29 ; 11.4,8.14 11.4,7.76 arc(11.43,7.62) 11.51,7.51 arc(11.55,7.46) 11.59,7.41 arc(11.61,7.36) 11.62,7.32 arc(11.64,7.25) 11.65,7.17 11.65,7.16 arc(11.61,7) 11.52,6.86 arc(11.41,6.69) 11.37,6.49 11.37,5.73 arc(11.38,5.67) 11.42,5.61 arc(11.45,5.56) 11.47,5.5 v12(11.47,5.11) ; 11.4,8.14 arc(11.41,8.21) 11.42,8.29 ; 11.4,8.14 arc(11.41,8.21) 11.42,8.29
CSI_PCLK: length 5.4
  Top Layer w0.158: 12.96,4.05 12.96,4.43 arc(12.98,4.56) 13.04,4.67 arc(13.06,4.68) 13.07,4.7 arc(13.16,4.84) 13.2,5 arc(13.2,5.03) 13.2,5.05 v12(13.2,5.11)
  Bottom Layer w0.152: v12(13.2,5.11) 13.2,6.45 arc(13.17,6.59) 13.1,6.7 13.09,6.71 arc(13.04,6.79) 13.02,6.88 13.02,7.64 arc(13.06,7.85) 13.17,8.02 13.33,8.18 arc(13.44,8.34) 13.48,8.52 13.48,9.22
CSI_VSYNC: length 9.7
  Top Layer w0.152: U1.27 15.01,9.66 arc(15.16,9.72) 15.23,9.88 15.23,10.46 arc(15.18,10.7) v12(15.05,10.9) ; v2(8.46,9.86) arc(8.61,9.96) 8.79,9.99 11.16,9.99 arc(11.27,10.04) v2(11.32,10.15)
  Bottom Layer w0.152: v2(11.32,10.15) arc(11.45,10.46) 11.76,10.59 14.74,10.59 arc(14.95,10.68) v12(15.05,10.9)
  Bottom Layer w0.203: FPC1.18 8.47,9.81 arc(8.47,9.84) v2(8.46,9.86)
IR_LED: length 12
  Top Layer w0.152: v2(8.46,6.23) 8.46,4.94 arc(8.55,4.72) 8.78,4.62 10.34,4.62 arc(10.49,4.56) 10.56,4.41 U1.6
  Bottom Layer w0.152: NOREF.1 1.98,7.4 2.45,7.88 arc(2.62,7.99) 2.81,8.03 4.36,8.03 arc(4.49,8) 4.6,7.92 4.68,7.84 arc(4.92,7.68) 5.21,7.63 6.52,7.63 arc(6.94,7.54) 7.3,7.3 7.55,7.05 arc(7.83,6.86) 8.15,6.8 arc(8.37,6.71) 8.46,6.49 v2(8.46,6.23)
LNA_IN: length 3.8
  Top Layer w0.203: U1.1 8.56,3.51
  Top Layer w0.35: 8.56,3.51 8.56,2.38 arc(8.39,1.99) 8,1.83 C23.2
  Top Layer w0.541: L4.1 7.62,1.83
PWDN: length 10.6
  Top Layer w0.152: 16.25,11.4 15.78,11.4 15.78,11.4 15.42,11.4 15.42,11.4 14.95,11.4 arc(14.41,11.18) 14.19,10.64 arc(14.16,10.5) 14.08,10.38 13.82,10.12 arc(13.34,9.8) 12.77,9.69 9.05,9.69 arc(8.88,9.62) 8.8,9.44 ; 8.8,9.44 v2(8.8,8.22)
  Bottom Layer w0.152: FPC1.17 8.97,8.64 arc(8.94,8.41) v2(8.8,8.22)
SPICLK: length 12
  Top Layer w0.152: v12(12.02,11.55) 12.02,11.36 12.08,11.3 12.08,11.02 12.18,10.93 arc(12.17,10.9) U1.33
  Top Layer w0.203: v12(18.21,4.93) 18.44,4.7 U2.6
  Inner2 w0.152: v12(12.02,11.55) 12.02,11.45 arc(12.21,10.91) 12.7,10.6 12.98,10.6 arc(13.13,10.57) 13.25,10.49 arc(13.32,10.42) 13.37,10.34 arc(13.89,9.98) 14.51,9.86 15.59,9.86 arc(15.7,9.86) 15.82,9.84 arc(16.32,9.7) 16.75,9.4 arc(17.05,8.96) 17.15,8.43 17.15,8.1 arc(17.26,7.52) 17.59,7.03 arc(17.74,6.81) 17.79,6.54 17.79,6.25 arc(17.84,5.99) 17.99,5.77 18.07,5.69 arc(18.18,5.53) 18.21,5.35 v12(18.21,4.93)
SPICS0: length 10.5
  Top Layer w0.152: U1.32 12.56,10.29 arc(12.52,10.2) v12(12.43,10.16)
  Top Layer w0.158: U2.1 15.88,6.3 arc(15.74,6.28) 15.62,6.2 v12(15.31,5.88)
  Inner2 w0.152: v12(15.31,5.88) 15.77,5.88 arc(16.06,5.94) 16.3,6.1 arc(16.47,6.35) 16.53,6.64 16.53,8.35 arc(16.52,8.44) 16.5,8.53 arc(16.42,8.77) 16.27,8.97 arc(16.05,9.13) 15.79,9.23 arc(15.69,9.24) 15.59,9.25 13.02,9.25 arc(12.6,9.43) 12.43,9.85 v12(12.43,10.16)
SPID: length 14.7
  Top Layer w0.152: v2(12.58,11.55) arc(12.45,11.73) 12.29,11.89 arc(12.09,11.99) 11.86,11.96 arc(11.73,11.87) 11.63,11.73 arc(11.59,11.63) 11.56,11.53 arc(11.51,11.42) 11.43,11.33 arc(11.4,11.28) 11.38,11.23 arc(11.36,11.05) U1.35
  Top Layer w0.203: U2.5 18.21,3.9 arc(18.15,3.92) 18.1,3.95 arc(18.06,4.02) 18.04,4.09 v12(18.04,4.38)
  Inner2 w0.152: v2(12.58,11.55) 12.58,11.16 arc(12.65,10.98) 12.83,10.91 13.03,10.91 arc(13.04,10.9) 13.06,10.9 ; v12(18.04,4.38) arc(18.29,4.43) 18.51,4.57 18.53,4.6 arc(18.61,4.72) 18.64,4.86 18.64,5.21 arc(18.58,5.52) 18.4,5.79 18.26,5.93 arc(18.14,6.11) 18.1,6.32 18.1,6.66 arc(18.04,6.96) 17.87,7.21 arc(17.56,7.67) 17.46,8.21 17.46,8.33 arc(17.46,8.35) 17.46,8.37 17.46,8.43 arc(17.45,8.5) 17.45,8.56 arc(17.41,8.83) 17.32,9.1 arc(17.21,9.33) 17.05,9.53 16.94,9.64 arc(16.53,9.94) 16.06,10.11 arc(15.85,10.15) 15.62,10.16 14.59,10.16 arc(14.04,10.27) 13.57,10.58 arc(13.52,10.65) 13.45,10.72 arc(13.27,10.84) 13.06,10.9
SPIHD: length 15.5
  Top Layer w0.152: U1.30 13.36,11.32 arc(13.29,11.49) v2(13.13,11.55)
  Top Layer w0.203: v12(17.66,5.11) 17.66,5.11 17.58,5.18 arc(17.8,5.22) 17.99,5.35 arc(18.16,5.46) 18.36,5.5 U2.7
  Inner2 w0.152: 17.61,4.47 arc(17.6,4.42) 17.6,4.36 arc(17.63,4.2) 17.72,4.07 arc(17.91,3.97) 18.12,3.93 arc(18.4,3.99) 18.64,4.14 18.8,4.31 arc(18.92,4.49) 18.96,4.7 18.96,5.23 arc(18.88,5.63) 18.66,5.97 18.58,6.04 arc(18.45,6.24) 18.4,6.48 18.4,6.71 arc(18.33,7.08) 18.12,7.39 18.07,7.44 arc(18.06,7.45) 18.05,7.46 arc(17.91,7.66) 17.81,7.89 arc(17.78,8.03) 17.77,8.18 17.77,8.39 arc(17.76,8.56) 17.74,8.72 arc(17.69,8.97) 17.6,9.21 arc(17.5,9.43) 17.37,9.64 arc(17.26,9.75) 17.16,9.86 17.15,9.86 arc(16.84,10.11) 16.49,10.29 arc(16.32,10.36) 16.13,10.41 arc(15.88,10.45) 15.62,10.47 14.58,10.47 arc(14.16,10.55) 13.8,10.79 ; 17.61,4.47 arc(17.63,4.51) 17.64,4.55 ; 17.61,4.47 arc(17.62,4.51) 17.64,4.55 ; 13.8,10.79 arc(13.73,10.87) 13.66,10.94 arc(13.5,11.06) 13.32,11.15 13.27,11.2 arc(13.27,11.21) 13.26,11.21 arc(13.16,11.37) v2(13.13,11.55) ; 17.6,5.07 arc(17.62,5.11) v12(17.66,5.11) 17.66,4.75 arc(17.65,4.65) 17.64,4.55
SPIQ: length 11.5
  Top Layer w0.152: U1.34 11.76,10.28 v12(11.87,10.16)
  Top Layer w0.158: U2.2 15.85,5.5 arc(15.78,5.49) 15.72,5.45 v12(15.56,5.28)
  Inner2 w0.152: v12(15.56,5.28) 15.35,5.28 arc(15.13,5.33) 14.95,5.45 arc(14.88,5.56) 14.85,5.69 14.85,5.85 arc(14.89,6.03) 14.99,6.19 15,6.2 arc(15.14,6.29) 15.3,6.33 15.71,6.33 arc(15.91,6.36) 16.08,6.48 arc(16.17,6.61) 16.2,6.78 16.2,8.39 arc(16.16,8.58) 16.05,8.75 arc(15.86,8.88) 15.63,8.93 12.76,8.93 arc(12.13,9.19) 11.87,9.82 v12(11.87,10.16)
SPIWP: length 10.6
  Top Layer w0.152: 12.96,10.87 12.96,10.18 arc(12.96,10.16) v12(12.98,10.16)
  Top Layer w0.158: v12(15.55,4.72) 16.17,4.72 arc(16.19,4.72) U2.3
  Inner2 w0.152: v12(12.98,10.16) arc(13.15,9.73) 13.58,9.56 15.59,9.56 arc(15.72,9.55) 15.86,9.53 arc(15.96,9.5) 16.07,9.46 arc(16.3,9.34) 16.5,9.18 arc(16.74,8.81) 16.83,8.38 16.83,6 arc(16.46,5.1) v12(15.55,4.72)
TWI_SCK: length 12.9
  Top Layer w0.152: v12(7.76,10.51) 7.96,10.51 arc(8.08,10.49) 8.17,10.43 arc(8.31,10.33) 8.48,10.3 10.29,10.3 arc(10.39,10.32) 10.47,10.38 arc(10.53,10.46) 10.56,10.57 U1.37 10.51,10.92 v2(10.51,11.58) ; 16.25,10.53 15.77,10.53 arc(15.58,10.71) v2(15.6,10.97)
  Inner2 w0.152: v2(10.51,11.58) 10.51,11.81 arc(10.57,11.96) 10.72,12.03 13.2,12.03 arc(13.52,11.89) 13.65,11.58 arc(13.79,11.24) 14.13,11.1 14.32,11.1 arc(14.49,11.13) 14.62,11.23 14.63,11.23 arc(14.82,11.36) 15.04,11.4 15.3,11.4 arc(15.51,11.31) 15.6,11.1 v2(15.6,10.97)
  Bottom Layer w0.152: FPC1.20 7.47,9.86 arc(7.51,10.06) 7.63,10.23 7.65,10.25 arc(7.7,10.3) 7.73,10.36 arc(7.75,10.44) v12(7.76,10.51)
TWI_SDA: length 17.4
  Top Layer w0.152: 18.78,11.4 v2(19.17,11.4) ; 10.96,10.87 10.96,11.41 arc(10.98,11.51) v12(11.06,11.58)
  Bottom Layer w0.152: 11.06,11.99 14.21,11.99 arc(14.3,11.97) 14.37,11.92 arc(14.41,11.89) 14.46,11.89 18.68,11.89 arc(19.03,11.74) v2(19.17,11.4) ; 11.06,11.99 v12(11.06,11.58) ; 11.06,11.99 arc(11,12.02) 10.94,12.04 7.14,12.04 arc(6.53,11.78) 6.27,11.17 6.27,10.28 arc(6.31,10.11) 6.4,9.98 arc(6.45,9.89) 6.47,9.8 FPC1.22
USB-DN: length 30.4
  Top Layer w0.152: v4(1.88,8.68) 1.88,8.44 arc(1.92,8.33) 2.04,8.28 2.52,8.28 2.73,8.5 CN1.4 ; U1.25 15.18,8.86 arc(15.44,8.91) 15.65,9.06 arc(15.85,9.19) 16.09,9.24 17.9,9.24 arc(18.05,9.27) v12(18.18,9.36)
  Bottom Layer w0.152: v12(18.18,9.36) 17.79,8.97 17.55,8.97 17.41,8.83 17.41,8.5 17.17,8.26 16.89,8.26 16.78,8.14 16.78,7.87 16.55,7.65 arc(16.42,7.45) 16.37,7.21 16.37,6.99 arc(16.37,6.91) 16.37,6.82 16.37,4.56 16.22,4.41 16.22,4.07 16.09,3.94 15.84,3.94 15.79,3.88 15.79,3.7 15.67,3.58 15.38,3.58 15.22,3.43 10.42,3.43 10.23,3.62 9.91,3.62 9.77,3.76 9.77,3.96 9.69,4.04 9.52,4.04 9.41,4.15 9.41,4.43 9.28,4.56 9.28,6.72 arc(9.1,7.2) 8.65,7.44 8.65,7.45 8.4,7.45 arc(8.24,7.48) 8.11,7.57 arc(7.29,8.12) 6.31,8.31 5.33,8.31 arc(5.2,8.34) 5.09,8.41 4.88,8.62 arc(4.71,8.73) 4.5,8.78 4.11,8.78 3.96,8.93 3.66,8.93 3.5,8.78 3.26,8.78 3.11,8.93 2.74,8.93 2.59,8.78 2.12,8.78 arc(1.99,8.75) v4(1.88,8.68)
USB-DP: length 31.6
  Top Layer w0.152: CN1.5 2.75,7.7 2.52,7.93 1.73,7.93 arc(1.53,8.01) v4(1.45,8.2) ; U1.26 15.1,9.26 arc(15.33,9.31) 15.52,9.43 arc(15.7,9.56) 15.92,9.6 17.39,9.6 arc(17.63,9.65) v12(17.83,9.78)
  Bottom Layer w0.152: v4(1.45,8.2) 2.09,8.2 arc(2.17,8.22) 2.24,8.27 2.3,8.33 arc(2.38,8.38) 2.48,8.4 4.52,8.4 arc(4.59,8.39) 4.65,8.35 4.91,8.09 arc(5.05,7.99) 5.23,7.96 6.31,7.96 arc(7.15,7.79) 7.86,7.32 arc(8.11,7.15) 8.4,7.09 8.55,7.09 arc(8.82,6.99) 8.93,6.72 8.93,4.61 arc(9.38,3.52) 10.47,3.07 15.22,3.07 arc(16.29,3.51) 16.73,4.58 16.73,7 arc(16.79,7.27) 16.94,7.5 18.48,9.04 arc(18.48,9.05) 18.48,9.05 arc(18.56,9.55) 18.11,9.78 v12(17.83,9.78)
XTAL_N: length 1.3
  Top Layer w0.152: OSC1.3 U1.53
$1N20382: length 3
  Top Layer w0.254: OSC1.4 6.47,7.95 arc(6.44,8.09) 6.36,8.2 6.34,8.23 arc(6.29,8.29) 6.28,8.37 6.28,10.41
$1N20736: length 5.2
  Top Layer w0.541: U13.1 2.13,0.58 arc(2.73,0.7) 3.25,1.04 3.67,1.46 arc(4.08,1.73) 4.56,1.83 L5.2 5.92,1.83 arc(5.92,1.83) 5.92,1.83
$1N28125: length 12.1
  Top Layer w0.152: v4(15.04,4.29) 15.04,3.99 arc(15.21,3.58) 15.62,3.4 arc(15.82,3.32) 15.9,3.13 R8.2 ; U1.51 8.61,6.86 arc(8.8,6.78) 8.89,6.58 8.89,5.36 arc(8.96,5.18) 9.14,5.11 v4(9.96,5.11)
  Bottom Layer w0.152: v4(9.96,5.11) 9.96,4.95 arc(10.31,4.1) 11.15,3.76 14.5,3.76 arc(14.88,3.91) v4(15.04,4.29)

## Copper pours and planes (outline as drawn; the poured copper is in the pictures)
1.2V on Top Layer: 3.63,10.64 2.51,10.64 2.41,10.75 2.41,11.87 2.52,11.98 3.62,11.98 3.73,11.87 3.73,10.74
3.3V on Top Layer: 7.3,3.26 6.34,3.26 6.21,3.4 6.21,5.22 6.35,5.36 8.08,5.36 8.1,5.34 8.1,4.76 8.08,4.74 7.53,4.74 7.43,4.64 7.43,3.39
3.3V on Top Layer: 3.61,10.41 3.68,10.34 3.68,9.89 3.62,9.83 1.58,9.83 1.31,9.55 1.05,9.55 0.84,9.76 0.84,10.69 0.98,10.84 1.3,10.84 1.45,10.69 1.45,10.51 1.55,10.41
3.3V on Bottom Layer: 0.97,11.1 1.65,11.1 1.73,11.02 1.73,10.89 1.5,10.66 1.5,10.44 1.91,10.03 1.91,9.14 1.75,8.99 1.12,8.99 0.81,9.3 0.81,10.95
3.3V on Bottom Layer: 8.91,11.8 10.66,11.8 10.66,8.53 8.91,8.53
3.3V on Inner2: 0.88,6.44 0.88,10.71 1.07,10.9 7.66,10.9 8.67,11.91 9.97,11.91 10.22,11.66 10.22,11.4 10.33,11.3 11.6,11.3 11.85,11.05 11.85,9.39 12.36,8.89 15.78,8.89 16.15,8.52 16.15,6.71 15.81,6.37 15.15,6.37 14.73,5.96 14.73,3.5 15.03,3.2 17.95,3.2 18.23,2.91 18.23,1.4 18.09,1.26 10.51,1.26 10.09,1.68 10.09,2.98 9.83,3.23 6.44,3.23 6.11,3.56 6.11,4.19 5.9,4.4 4.86,4.4 4.69,4.57 4.69,5.78 4.45,6.03 1.3,6.03
GND on Top Layer: 0,12.99 20.5,12.99 20.5,-0.01 0,-0.01
GND on Bottom Layer: 0,12.99 20.5,12.99 20.5,0.01 0,0.01
GND on Inner1: 4.97,7.96 6.87,7.96 6.87,5.56 4.97,5.56
GND on Inner1: 0,12.99 20.5,12.99 20.5,0.01 0,0.01
$1N1778 on Top Layer: 8.82,4.36 9.47,4.36 9.47,3.54 10.09,2.92 10.17,2.92 10.22,2.87 10.22,2.33 10.17,2.28 9.49,2.28 9.44,2.33 9.44,2.91 8.82,3.52

## Text on the board
Bottom Silkscreen Layer: GND | PWM+
